# Altium project Clock_Led.PrjPcb
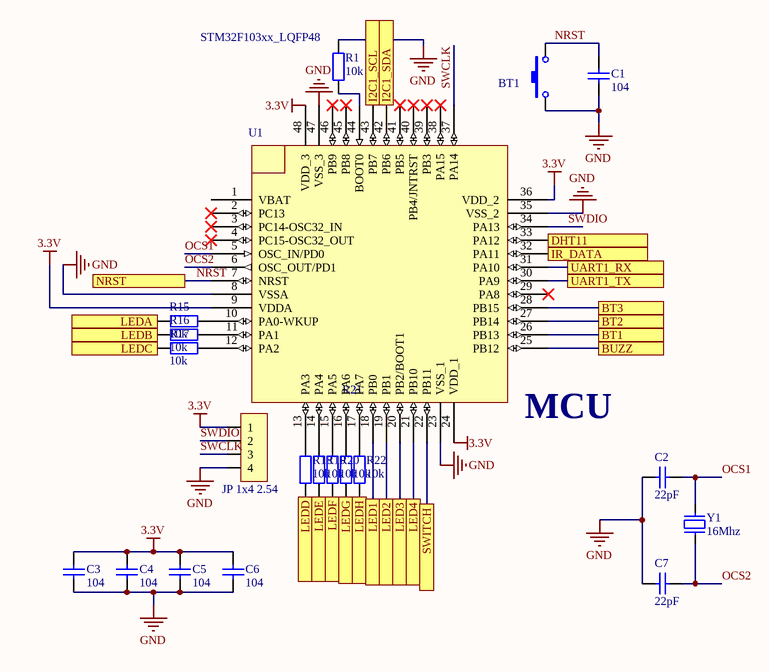
[diagram p0: MCU_Clock_Led.SchDoc]
8 sheets, 71 parts. Net scope: flat (ports and power ports of the same name join across sheets).
Board file: PCB_Clock_Led.PcbDoc
Sheets:
  MCU_Clock_Led.SchDoc
  7SEG_ClockLed.SchDoc
  Power_ClockLed.SchDoc
  Button_ClockLed.SchDoc
  ESP8266_ClockLed.SchDoc
  Relay_ClockLed.SchDoc
  DS3231_ClockLed.SchDoc
  SenSor_ClockLed.SchDoc

## Sheet MCU_Clock_Led.SchDoc
size A4; SheetNumber: 1; SheetTotal: 8

### Parts
BT1  Nut Nhan 2 Chan SMD 3x6x2.5  [Nut Nhan 2 Chan SMD 3x6x2.5]  (value not drawn)
C1  104  [tu 0805]
C2  22pF  [tu 0805]
C3  104  [tu 0805]
C4  104  [tu 0805]
C5  104  [tu 0805]
C6  104  [tu 0805]
C7  22pF  [tu 0805]
JP2  JP 1x4 2.54  [JP 1x4 DT]
R1  10k  [tro smd 0805]
R15  10k  [tro smd 0805]
R16  10k  [tro smd 0805]
R17  10k  [tro smd 0805]
R18  10k  [tro smd 0805]
R19  10k  [tro smd 0805]
R20  10k  [tro smd 0805]
R21  10k  [tro smd 0805]
R22  10k  [tro smd 0805]
U1  STM32F103xx_LQFP48  [STM32_LQPF48]
Y1  16Mhz  [Thach Anh 2 chan SMD]

### Ports
BT1, BT2, BT3, BUZZ, DHT11, I2C1_SCL, I2C1_SDA, IR_DATA, LED1, LED2, LED3, LED4, LEDA, LEDB, LEDC, LEDD, LEDE, LEDF, LEDG, LEDH, NRST, SWITCH, UART1_RX, UART1_TX

### Nets
3.3V: C3.1 C4.1 C5.1 C6.1 JP2.1 U1.9(VDDA) U1.24(VDD_1) U1.36(VDD_2) U1.48(VDD_3)
GND: BT1.1 C1.2 C2.1 C3.2 C4.2 C5.2 C6.2 C7.1 JP2.4 R1.2 U1.8(VSSA) U1.23(VSS_1) U1.26(PB13) U1.35(VSS_2) U1.47(VSS_3) ; port BT1
NRST: BT1.2 C1.1 U1.7(NRST) ; port NRST
OCS1: C2.2 U1.5(OSC_IN/PD0) Y1.2
OCS2: C7.2 U1.6(OSC_OUT/PD1) Y1.1
SWCLK: JP2.3 U1.37(PA14)
SWDIO: JP2.2 U1.34(PA13)
NetBT3_1: U1.27(PB14) ; port BT2
NetBT5_1: U1.28(PB15) ; port BT3
NetDS1_1: R19.1 ; port LEDE
NetDS1_2: R18.1 ; port LEDD
NetDS1_4: R17.1 ; port LEDC
NetDS1_5: R22.1 ; port LEDH
NetDS1_6: R16.1 ; port LEDB
NetDS1_7: R15.1 ; port LEDA
NetDS1_9: R20.1 ; port LEDF
NetDS1_10: R21.1 ; port LEDG
NetJP1_2: U1.33(PA12) ; port DHT11
NetJP3_2: U1.32(PA11) ; port IR_DATA
NetMD1_1: U1.30(PA9) ; port UART1_TX
NetMD1_8: U1.31(PA10) ; port UART1_RX
NetR1_1: R1.1 U1.44(BOOT0)
NetR2_1: U1.22(PB11) ; port SWITCH
NetR7_1: U1.18(PB0) ; port LED1
NetR8_1: U1.19(PB1) ; port LED2
NetR9_1: U1.20(PB2/BOOT1) ; port LED3
NetR10_1: U1.21(PB10) ; port LED4
NetR11_1: U1.42(PB6) ; port I2C1_SDA
NetR15_2: R15.2 U1.10(PA0-WKUP)
NetR16_2: R16.2 U1.11(PA1)
NetR17_2: R17.2 U1.12(PA2)
NetR18_2: R18.2 U1.13(PA3)
NetR19_2: R19.2 U1.14(PA4)
NetR20_2: R20.2 U1.15(PA5)
NetR21_2: R21.2 U1.16(PA6)
NetR22_2: R22.2 U1.17(PA7)
NetU1_25: U1.25(PB12) ; port BUZZ
NetU1_43: U1.43(PB7) ; port I2C1_SCL

Not connected (* = marked no-connect by the designer): U1 1(VBAT) 2(PC13)* 3(PC14-OSC32_IN)* 4(PC15-OSC32_OUT)* 29(PA8)* 38(PA15)* 39(PB3)* 40(PB4/JNTRST)* 41(PB5)* 45(PB8)* 46(PB9)*

### Notes on the sheet
- (near U1) MCU

### Library data of the parts
BT1 = Nut Nhan 2 Chan SMD 3x6x2.5: Ma_Hang: MH001036; Ten: Nút Nhấn 2 Chân 3x6x2.5MM SMD
C1 C3-C6 = Tu 0805 104 50V 10%: Dán; Don_Vi: Con; So_Chan: 2; Ten_Linh_Kien: Tụ 0805 104-100nF 10% 50V; Ma_Hang: MH004551; Chung_Loai: Dán; Kieu_Chan: *
C2 C7 = Tu 0805 22pF 50V 10%: Dán; Don_Vi: Con; So_Chan: 2; Ten_Linh_Kien: Tụ 0805 22P 10% 50V; Ma_Hang: MH004560; Chung_Loai: Dán; Kieu_Chan: *
JP2 = JP 1x4 2.54 Duc Thang: Cắm; Ten_Linh_Kien: Jump Đơn Đực 2.54MM 1x40P Thẳng 11MM; Don_Vi: Con; Ma_Hang: MH000903; Ghi_Chu: *; Kieu_Chan: *; Chung_Loai: Cắm
R1 R15-R22 = Tro 0805 5% 10k: Dán; Don_Vi: Con; So_Chan: 2; Ten_Linh_Kien: Trở 0805 5% 10k; Ma_Hang: MH005239; Chung_Loai: Dán; Kieu_Chan: *
Y1 = Thach Anh 2 chan SMD: Crystal For all Crystal 2pin.; Value: 4Mhz
U1 = STM32F103xx_LQFP48: Published: 30-May-2008; DatasheetVersion: rev6, Mar-2008; PackageVersion: Mar-2008; PackageReference: LQFP48; Publisher: Altium Limited; PackageDescription: 48-Pin Low-Profile Quad Flat Pack, 7 x 7 mm Body, 0.5 mm Pitch (LQFP48); ComponentLink1Description: Manufacturer Link; ComponentLink1URL: www.st.com/stm32; ComponentLink2Description: Datasheet; ComponentLink2URL: http://www.st.com/stonline/products/literature/ds/13587.pdf

## Sheet 7SEG_ClockLed.SchDoc
size A4; SheetNumber: 2; SheetTotal: 8
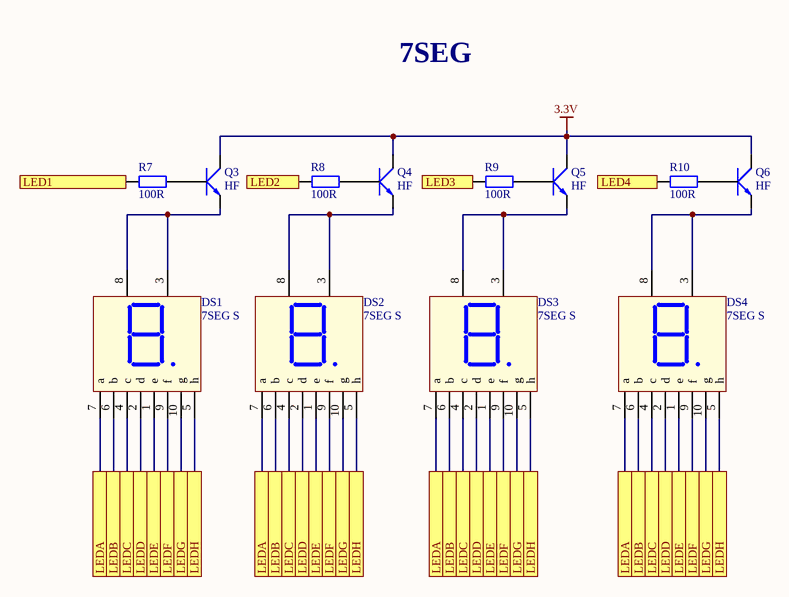
[diagram p1: 7SEG_ClockLed.SchDoc]

### Parts
DS1  7SEG S  [7SEGS]
DS2  7SEG S  [7SEGS]
DS3  7SEG S  [7SEGS]
DS4  7SEG S  [7SEGS]
Q3  HF  [SOT23]
Q4  HF  [SOT23]
Q5  HF  [SOT23]
Q6  HF  [SOT23]
R7  100R  [tro smd 0805]
R8  100R  [tro smd 0805]
R9  100R  [tro smd 0805]
R10  100R  [tro smd 0805]

### Ports
LED1, LED2, LED3, LED4, LEDA, LEDB, LEDC, LEDD, LEDE, LEDF, LEDG, LEDH

### Nets
3.3V: Q3.3(C) Q4.3(C) Q5.3(C) Q6.3(C)
NetDS1_1: DS1.1(e) DS2.1(e) DS3.1(e) DS4.1(e) ; port LEDE
NetDS1_2: DS1.2(d) DS2.2(d) DS3.2(d) DS4.2(d) ; port LEDD
NetDS1_3: DS1.3(Vcc) DS1.8(Vcc) Q3.2(E)
NetDS1_4: DS1.4(c) DS2.4(c) DS3.4(c) DS4.4(c) ; port LEDC
NetDS1_5: DS1.5(h) DS2.5(h) DS3.5(h) DS4.5(h) ; port LEDH
NetDS1_6: DS1.6(b) DS2.6(b) DS3.6(b) DS4.6(b) ; port LEDB
NetDS1_7: DS1.7(a) DS2.7(a) DS3.7(a) DS4.7(a) ; port LEDA
NetDS1_9: DS1.9(f) DS2.9(f) DS3.9(f) DS4.9(f) ; port LEDF
NetDS1_10: DS1.10(g) DS2.10(g) DS3.10(g) DS4.10(g) ; port LEDG
NetDS2_3: DS2.3(Vcc) DS2.8(Vcc) Q4.2(E)
NetDS3_3: DS3.3(Vcc) DS3.8(Vcc) Q5.2(E)
NetDS4_3: DS4.3(Vcc) DS4.8(Vcc) Q6.2(E)
NetQ3_1: Q3.1(B) R7.2
NetQ4_1: Q4.1(B) R8.2
NetQ5_1: Q5.1(B) R9.2
NetQ6_1: Q6.1(B) R10.2
NetR7_1: R7.1 ; port LED1
NetR8_1: R8.1 ; port LED2
NetR9_1: R9.1 ; port LED3
NetR10_1: R10.1 ; port LED4

### Notes on the sheet
- 7SEG

### Library data of the parts
DS1-DS4 = LED7S: Single 7 Seg Dipslay; Value: LED 7S SEG
Q3-Q6 = C1815 HF SMD: NPN transistor; Value: C9014
R7-R10 = Tro 0805 5% 100R: Dán; Don_Vi: Con; So_Chan: 2; Ten_Linh_Kien: Trở 0805 5% 100R; Ma_Hang: MH005251; Chung_Loai: Dán; Kieu_Chan: *

## Sheet Power_ClockLed.SchDoc
size A4; SheetNumber: 3; SheetTotal: 8
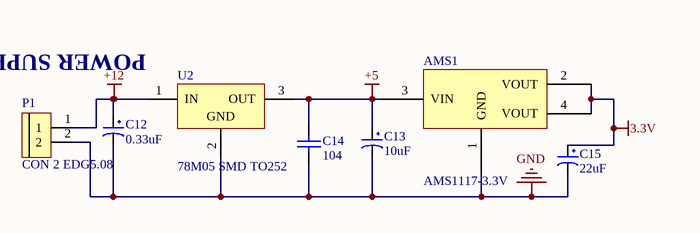
[diagram p2: Power_ClockLed.SchDoc]

### Parts
AMS1  AMS1117-3.3V  [SOT223]
C12  0.33uF  [tu hoa 5mm]
C13  10uF  [tu hoa 13mm]
C14  104  [tu 0805]
C15  22uF  [tu hoa 5mm]
P1  CON 2 EDG5.08  [CON 2 2EDG5.08]
U2  78M05 SMD TO252  [TO252]

### Nets
3.3V: AMS1.2(VOUT) AMS1.4(VOUT) C15.1
+5: AMS1.3(VIN) C13.1 C14.1 U2.3(OUT)
+12: C12.1 P1.1 U2.1(IN)
GND: AMS1.1(GND) C12.2 C13.2 C14.2 C15.2 P1.2 U2.2(GND)

### Notes on the sheet
- POWER SUPPLY

### Library data of the parts
AMS1 = AMS1117 SMD: Dán; Value: AMS1117-3.3V SOT223; Don_Vi: Con; Ma_Hang: MH000596; Ghi_Chu: *; Kieu_Chan: *; Chung_Loai: Dán
C12 = Tu Hoa 0.33uF 50V 5x11: Cắm; Don_Vi: Con; So_Chan: 2; Ten_Linh_Kien: Tụ Hóa 0.33uF 50V 5x11MM; Ma_Hang: MH004655; Chung_Loai: Cắm; Kieu_Chan: *
C13 = Tu Hoa 10uF 450V 13x20: Cắm; Don_Vi: Con; So_Chan: 2; Ten_Linh_Kien: Tụ Hóa 10uF 450V 13x20MM; Ma_Hang: MH003950; Chung_Loai: Cắm; Kieu_Chan: *
C14 = Tu 0805 104 50V 10%: as C1 on sheet MCU_Clock_Led; Chung_Loai: Dán; Kieu_Chan: *
C15 = Tu Hoa 22uF 35V 5x11: Cắm; Don_Vi: Con; So_Chan: 2; Ten_Linh_Kien: Tụ Hóa 22uF 35V 5x11MM; Ma_Hang: MH001350; Chung_Loai: Cắm; Kieu_Chan: *
P1 = CON 2 EDG5.08: Cắm; Ten_Linh_Kien: CON 2 2EDG5.08-2P 5.08MM ( Xanh Cong); Ma_Hang: MH000759; Ghi_Chu: *; Don_Vi: Con; Kieu_Chan: *; Chung_Loai: Cắm
U2 = 78M05 SMD TO252: Dán; Don_Vi: Con; Ten_Linh_Kien: 78M05 TO252; Ma_Hang: MH001917; Ghi_Chu: *; Kieu_Chan: *; Chung_Loai: Dán

## Sheet Button_ClockLed.SchDoc
size A4; SheetNumber: 4; SheetTotal: 8
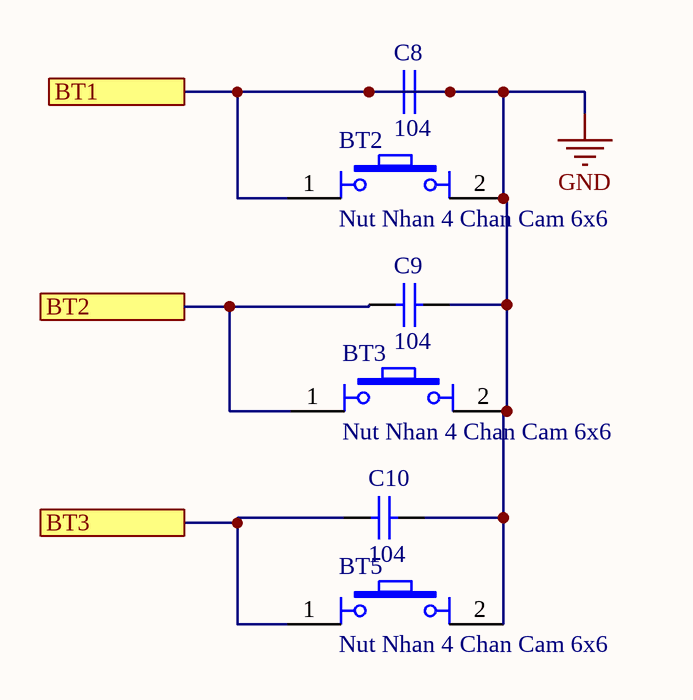
[diagram p3: Button_ClockLed.SchDoc]

### Parts
BT2  Nut Nhan 4 Chan Cam 6x6  [Nut Nhan 4 Chan Cam 6x6]
BT3  Nut Nhan 4 Chan Cam 6x6  [Nut Nhan 4 Chan Cam 6x6]
BT5  Nut Nhan 4 Chan Cam 6x6  [Nut Nhan 4 Chan Cam 6x6]
C8  104  [tu 0805]
C9  104  [tu 0805]
C10  104  [tu 0805]

### Ports
BT1, BT2, BT3

### Nets
GND: BT2.1 BT2.2 BT3.2 BT5.2 C8.1 C8.2 C9.2 C10.1 ; port BT1
NetBT3_1: BT3.1 C9.1 ; port BT2
NetBT5_1: BT5.1 C10.2 ; port BT3

### Library data of the parts
BT2 BT3 BT5 = Nut Nhan 4 Chan Cam 6x6: Nut Nhan 4 Chan 6x6mm; Ten: Nút Nhấn 4 Chân 6x6x5MM DIP; Ma_Hang: MH004584
C8-C10 = Tu 0805 104 50V 10%: as C1 on sheet MCU_Clock_Led; Chung_Loai: Dán; Kieu_Chan: *

## Sheet ESP8266_ClockLed.SchDoc
size A4; SheetNumber: 5; SheetTotal: 8
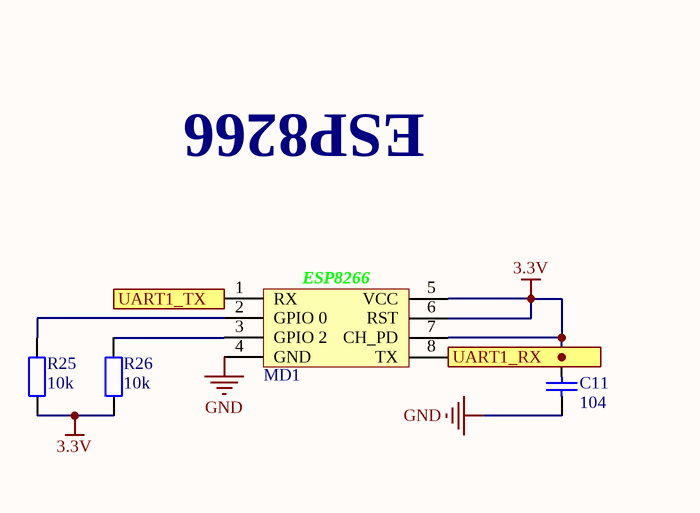
[diagram p4: ESP8266_ClockLed.SchDoc]

### Parts
C11  104  [tu 0805]
MD1  ESP8266 Module  [ESP2866 Module]  (value not drawn)
R25  10k  [tro smd 0805]
R26  10k  [tro smd 0805]

### Ports
UART1_RX, UART1_TX

### Nets
3.3V: C11.2 MD1.5(VCC) MD1.6(RST) MD1.7(CH_PD) R25.1 R26.1
GND: C11.1 MD1.4(GND)
NetMD1_1: MD1.1(RX) ; port UART1_TX
NetMD1_2: MD1.2(GPIO_0) R25.2
NetMD1_3: MD1.3(GPIO_2) R26.2
NetMD1_8: MD1.8(TX) ; port UART1_RX

### Notes on the sheet
- ESP8266
- (in symbol ESP8266 Module) ESP8266

### Library data of the parts
C11 = Tu 0805 104 50V 10%: as C1 on sheet MCU_Clock_Led; Chung_Loai: Dán; Kieu_Chan: *
R25 R26 = Tro 0805 5% 10k: as R1 on sheet MCU_Clock_Led; Chung_Loai: Dán; Kieu_Chan: *

## Sheet Relay_ClockLed.SchDoc
size A4; SheetNumber: 6; SheetTotal: 8
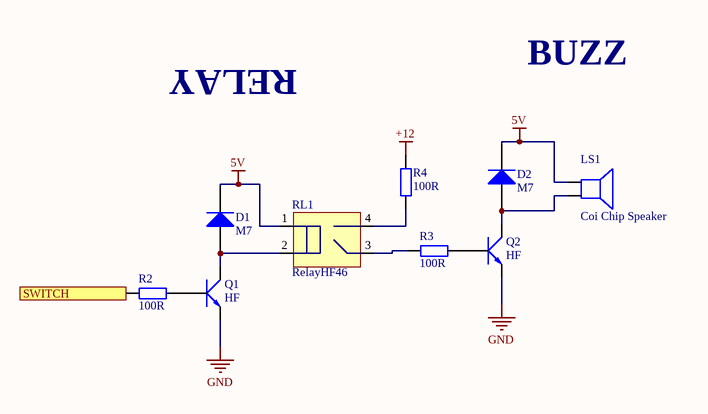
[diagram p5: Relay_ClockLed.SchDoc]

### Parts
D1  M7  [DIODE SMA]
D2  M7  [DIODE SMA]
LS1  Coi Chip Speaker  [Coi Chip Speacker]
Q1  HF  [SOT23]
Q2  HF  [SOT23]
R2  100R  [tro smd 0805]
R3  100R  [tro smd 0805]
R4  100R  [tro smd 0805]
RL1  RelayHF46  [Relay 4 chan HF46F]

### Ports
SWITCH

### Nets
5V: D1.2(K) D2.2(K) LS1.1 RL1.1
+12: R4.2
GND: Q1.2(E) Q2.2(E)
NetD1_1: D1.1(A) Q1.3(C) RL1.2
NetD2_1: D2.1(A) LS1.2 Q2.3(C)
NetQ1_1: Q1.1(B) R2.2
NetQ2_1: Q2.1(B) R3.2
NetR2_1: R2.1 ; port SWITCH
NetR3_1: R3.1 RL1.3(AC/DC)
NetR4_1: R4.1 RL1.4(AC/DC)

### Notes on the sheet
- RELAY
- BUZZ

### Library data of the parts
D1 D2 = Diode M7 ( 4007 ): Dán; Don_Vi: Con; Ten_Linh_Kien: Diode M7 1N4007 SMD 1A 1000V; Ma_Hang: MH000944; Chung_Loai: Dán; Ghi_Chu: *
LS1 = Coi Chip Speaker: Còi chip
Q1 Q2 = C1815 HF SMD: NPN transistor; Value: C9014
R2-R4 = Tro 0805 5% 100R: as R7 on sheet 7SEG_ClockLed; Chung_Loai: Dán; Kieu_Chan: *
RL1 = Relay 4 chan HF46F: Ten: Relay 5V5A HF46F-G 5-HS1; Ma_Hang: MH003879

## Sheet DS3231_ClockLed.SchDoc
size A4; SheetNumber: 7; SheetTotal: 8
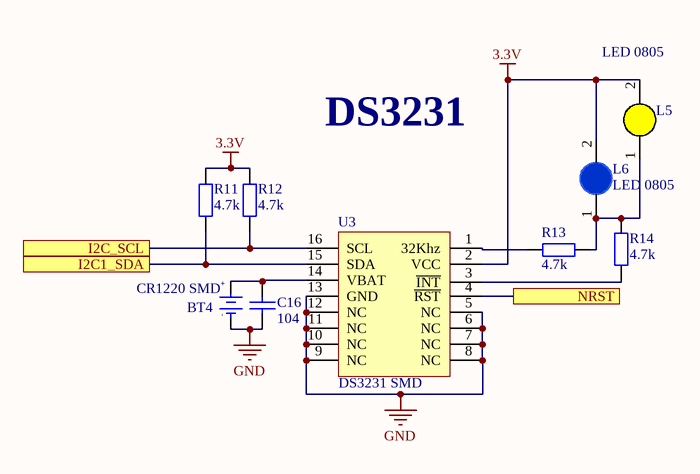
[diagram p6: DS3231_ClockLed.SchDoc]

### Parts
BT4  CR1220 SMD  [DE PIN CR1220]
C16  104  [tu 0805]
L5  LED 0805  [LED-1206-Yellow]
L6  LED 0805  [LED-0805-Blue]
R11  4.7k  [tro smd 0805]
R12  4.7k  [tro smd 0805]
R13  4.7k  [tro smd 0805]
R14  4.7k  [tro smd 0805]
U3  DS3231 SMD  [SOIC 16]

### Ports
I2C1_SDA, I2C_SCL, NRST

### Nets
3.3V: L5.2(K) L6.2(K) R11.2 R12.2 U3.2(VCC)
GND: BT4.2(GND) C16.2 U3.5(NC) U3.6(NC) U3.7(NC) U3.8(NC) U3.9(NC) U3.10(NC) U3.11(NC) U3.12(NC) U3.13(GND)
NRST: U3.4(~{RST}) ; port NRST
NetBT4_1: BT4.1(+3V) C16.1 U3.14(VBAT)
NetL5_1: L5.1(A) L6.1(A) R13.1 R14.1
NetR11_1: R11.1 U3.15(SDA) ; port I2C1_SDA
NetR12_1: R12.1 U3.16(SCL) ; port I2C_SCL
NetR13_2: R13.2 U3.1(32Khz)
NetR14_2: R14.2 U3.3(~{INT})

### Notes on the sheet
- DS3231
- (in symbol De pin CR1220 SMD) +; -

### Library data of the parts
BT4 = De pin CR1220 SMD: Ten: Đế PIN CR1220 SMD; Ma_Hang: MH000833
C16 = Tu 0805 104 50V 10%: as C1 on sheet MCU_Clock_Led; Chung_Loai: Dán; Kieu_Chan: *
L5 = LED 1206 Vang: Dán; Don_Vi: Con; Ma_Hang: MH002331; Ten_Linh_Kien: LED1206 Màu Vàng (Yellow); Ghi_Chu: *; Kieu_Chan: *; Chung_Loai: Dán
L6 = LED 0805 Xanh Duong: Dán; Don_Vi: Con; Ma_Hang: MH002327; Ten_Linh_Kien: LED 0805 Màu Xanh Dương (Blue); Ghi_Chu: *; Kieu_Chan: *; Chung_Loai: Dán
R11-R14 = Tro 0805 5% 4.7k: Dán; Don_Vi: Con; So_Chan: 2; Ten_Linh_Kien: Trở 0805 5% 4.7k; Ma_Hang: MH005307; Chung_Loai: Dán; Kieu_Chan: *
U3 = DS3231 SMD: SOIC

## Sheet SenSor_ClockLed.SchDoc
size A4; SheetNumber: 8; SheetTotal: 8
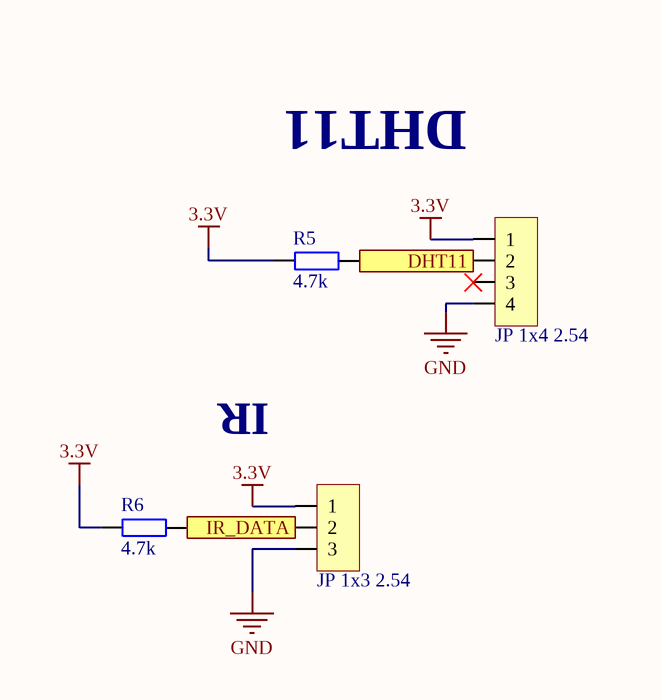
[diagram p7: SenSor_ClockLed.SchDoc]

### Parts
JP1  JP 1x4 2.54  [JP 1x4 DT]
JP3  JP 1x3 2.54  [JP 1x3 CT]
R5  4.7k  [tro smd 0805]
R6  4.7k  [tro smd 0805]

### Ports
DHT11, IR_DATA

### Nets
3.3V: JP1.1 JP3.1 R5.1 R6.1
GND: JP1.4 JP3.3
NetJP1_2: JP1.2 R5.2 ; port DHT11
NetJP3_2: JP3.2 R6.2 ; port IR_DATA

Not connected (* = marked no-connect by the designer): JP1 3*

### Notes on the sheet
- DHT11
- IR

### Library data of the parts
JP1 = JP 1x4 2.54 Duc Thang: as JP2 on sheet MCU_Clock_Led; Ghi_Chu: *; Kieu_Chan: *; Chung_Loai: Cắm
JP3 = JP 1x3 2.54 Cai Thang: Cắm; Ten_Linh_Kien: Jump Đơn Cái 2.54MM 1x20P Thẳng; Don_Vi: Con; Ma_Hang: MH004006; Ghi_Chu: *; Kieu_Chan: *; Chung_Loai: Cắm
R5 R6 = Tro 0805 5% 4.7k: as R11 on sheet DS3231_ClockLed; Chung_Loai: Dán; Kieu_Chan: *

## Nets that join several sheets
3.3V: MCU_Clock_Led (9 pins), 7SEG_ClockLed (Q3.3 Q4.3 Q5.3 Q6.3), Power_ClockLed (AMS1.2 AMS1.4 C15.1), ESP8266_ClockLed (6 pins), DS3231_ClockLed (5 pins), SenSor_ClockLed (JP1.1 JP3.1 R5.1 R6.1)
+12: Power_ClockLed (C12.1 P1.1 U2.1), Relay_ClockLed (R4.2)
GND: MCU_Clock_Led (15 pins), Power_ClockLed (7 pins), Button_ClockLed (8 pins), ESP8266_ClockLed (C11.1 MD1.4), Relay_ClockLed (Q1.2 Q2.2), DS3231_ClockLed (11 pins), SenSor_ClockLed (JP1.4 JP3.3)
NetBT3_1: MCU_Clock_Led (U1.27), Button_ClockLed (BT3.1 C9.1)
NetBT5_1: MCU_Clock_Led (U1.28), Button_ClockLed (BT5.1 C10.2)
NetDS1_1: MCU_Clock_Led (R19.1), 7SEG_ClockLed (DS1.1 DS2.1 DS3.1 DS4.1)
NetDS1_2: MCU_Clock_Led (R18.1), 7SEG_ClockLed (DS1.2 DS2.2 DS3.2 DS4.2)
NetDS1_4: MCU_Clock_Led (R17.1), 7SEG_ClockLed (DS1.4 DS2.4 DS3.4 DS4.4)
NetDS1_5: MCU_Clock_Led (R22.1), 7SEG_ClockLed (DS1.5 DS2.5 DS3.5 DS4.5)
NetDS1_6: MCU_Clock_Led (R16.1), 7SEG_ClockLed (DS1.6 DS2.6 DS3.6 DS4.6)
NetDS1_7: MCU_Clock_Led (R15.1), 7SEG_ClockLed (DS1.7 DS2.7 DS3.7 DS4.7)
NetDS1_9: MCU_Clock_Led (R20.1), 7SEG_ClockLed (DS1.9 DS2.9 DS3.9 DS4.9)
NetDS1_10: MCU_Clock_Led (R21.1), 7SEG_ClockLed (DS1.10 DS2.10 DS3.10 DS4.10)
NetJP1_2: MCU_Clock_Led (U1.33), SenSor_ClockLed (JP1.2 R5.2)
NetJP3_2: MCU_Clock_Led (U1.32), SenSor_ClockLed (JP3.2 R6.2)
NetMD1_1: MCU_Clock_Led (U1.30), ESP8266_ClockLed (MD1.1)
NetMD1_8: MCU_Clock_Led (U1.31), ESP8266_ClockLed (MD1.8)
NetR2_1: MCU_Clock_Led (U1.22), Relay_ClockLed (R2.1)
NetR7_1: MCU_Clock_Led (U1.18), 7SEG_ClockLed (R7.1)
NetR8_1: MCU_Clock_Led (U1.19), 7SEG_ClockLed (R8.1)
NetR9_1: MCU_Clock_Led (U1.20), 7SEG_ClockLed (R9.1)
NetR10_1: MCU_Clock_Led (U1.21), 7SEG_ClockLed (R10.1)
NetR11_1: MCU_Clock_Led (U1.42), DS3231_ClockLed (R11.1 U3.15)
NRST: MCU_Clock_Led (BT1.2 C1.1 U1.7), DS3231_ClockLed (U3.4)